# Altium schematic sheet hdmi.SchDoc
size 720 x 297 mm
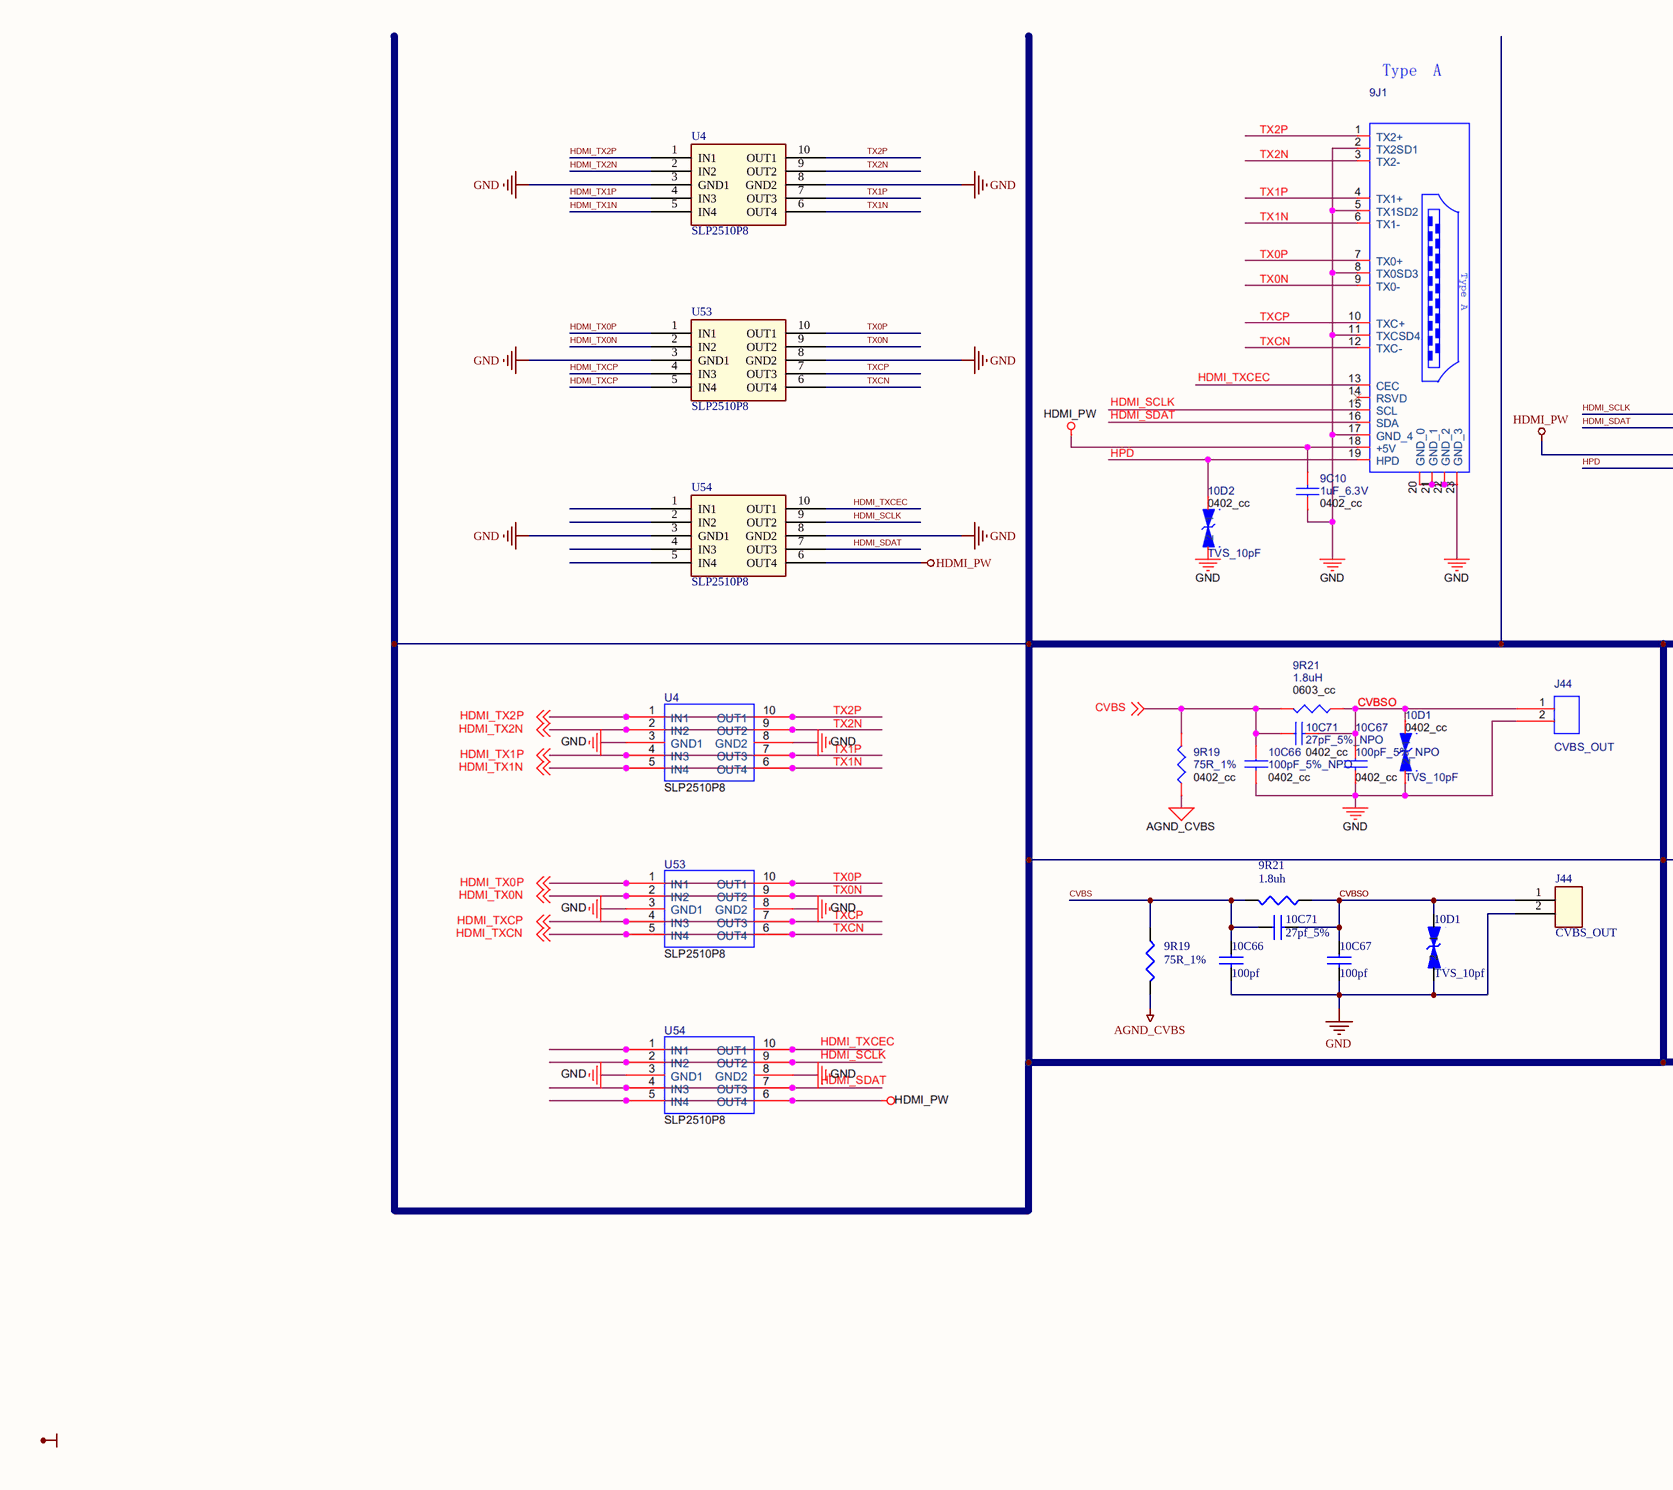
[diagram p0: hdmi.SchDoc, left]
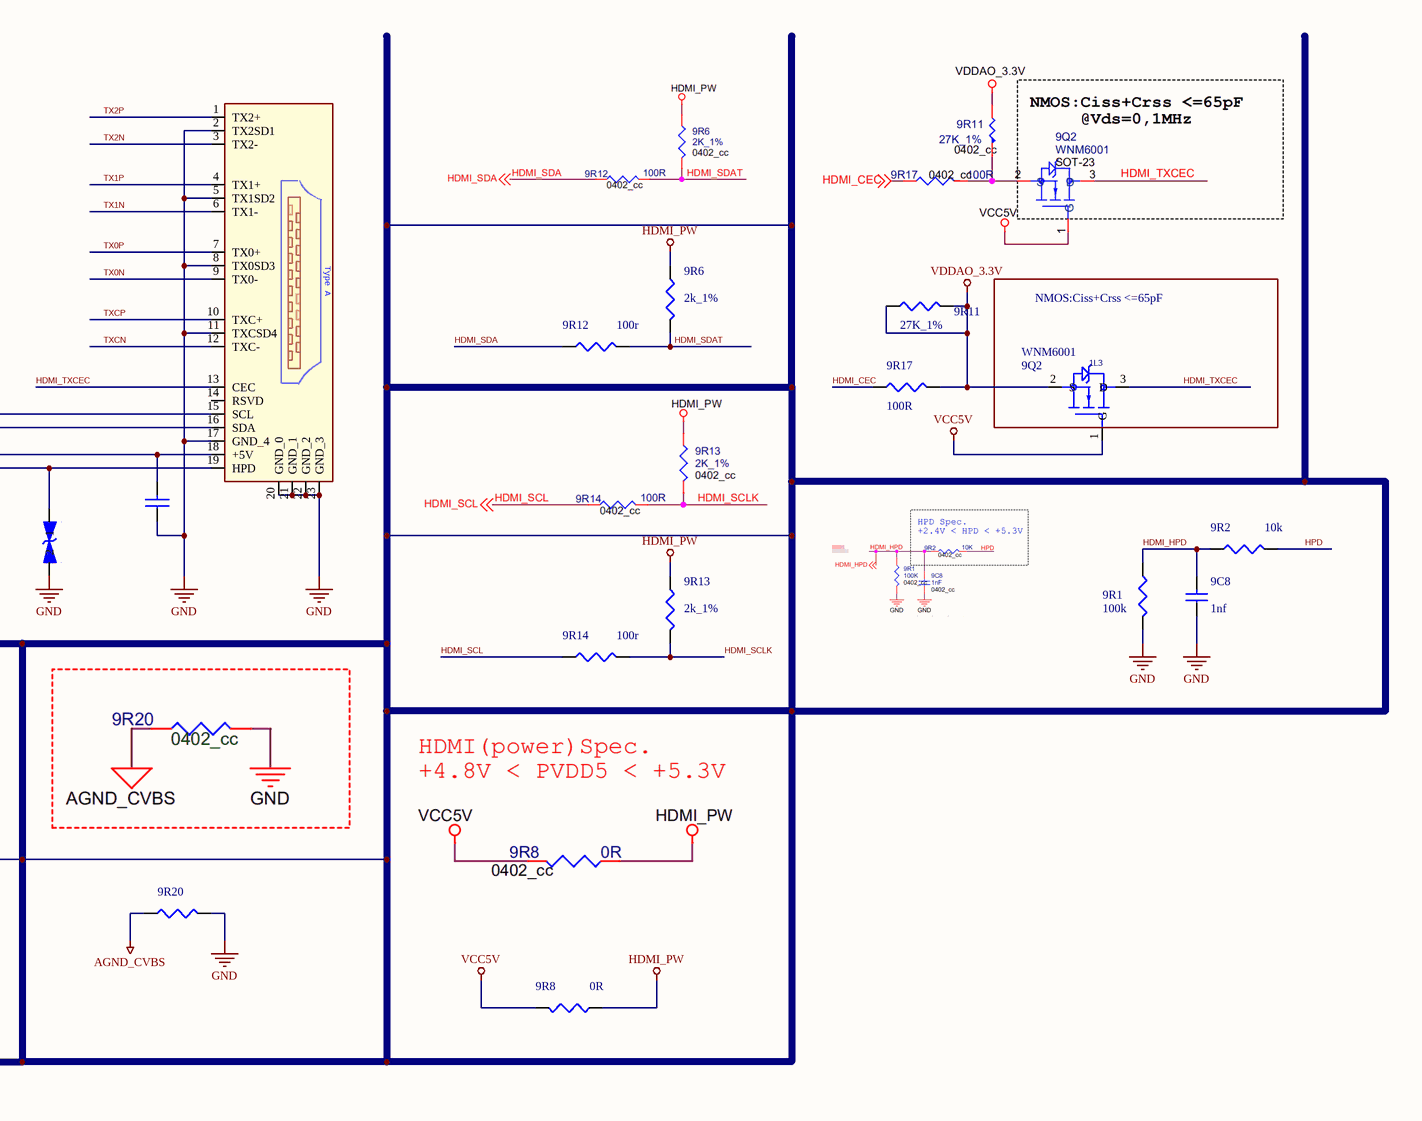
[diagram p1: hdmi.SchDoc, right]

## Parts
9C8  1nf  [0603C]
9C10  (no value)
9J1  (no value)
9Q2  WNM6001  J102: 1L3
9R1  100k
9R2  10k
9R6  2k_1%
9R8  0R
9R11  27K_1%
9R12  100r
9R13  2k_1%
9R14  100r
9R17  100R
9R19  75R_1%
9R20  (no value)
9R21  1.8uh
10C66  100pf
10C67  100pf
10C71  27pf_5%
10D1  TVS_10pf
10D2  (no value)
J44  CVBS_OUT
U4  SLP2510P8
U53  SLP2510P8
U54  SLP2510P8

## Blocks framed on the sheet
NMOS:Ciss+Crss <=65pF: 9Q2

## Nets
AGND_CVBS: 9R19.2 9R20.1
GND: 9C8.1 9C10.1 9J1.2(TX2SD1) 9J1.5(TX1SD2) 9J1.8(TX0SD3) 9J1.11(TXCSD4) 9J1.17(GND_4) 9J1.20(GND_0) 9J1.21(GND_1) 9J1.22(GND_2) 9J1.23(GND_3) 9R1.2 9R20.2 10C66.2 10C67.2 10D1.2 10D2.2 J44.2 U4.3(GND1) U4.8(GND2) U53.3(GND1) U53.8(GND2) U54.3(GND1) U54.8(GND2)
HDMI_PW: 9C10.2 9J1.18(+5V) 9R6.1 9R8.1 9R13.1 U54.6(OUT4)
VCC5V: 9Q2.1(G) 9R8.2
VDDAO_3.3V: 9Q2.2(S) 9R11.1 9R11.2 9R17.1
CVBS: 9R19.1 9R21.2 10C66.1 10C71.1
CVBSO: 9R21.1 10C67.1 10C71.2 10D1.1 J44.1
HDMI_CEC: 9R17.2
HDMI_HPD: 9C8.2 9R1.1 9R2.1
HDMI_SCL: 9R14.1
HDMI_SCLK: 9J1.15(SCL) 9R13.2 9R14.2 U54.9(OUT2)
HDMI_SDA: 9R12.1
HDMI_SDAT: 9J1.16(SDA) 9R6.2 9R12.2 U54.7(OUT3)
HDMI_TX0N: U53.2(IN2)
HDMI_TX0P: U53.1(IN1)
HDMI_TX1N: U4.5(IN4)
HDMI_TX1P: U4.4(IN3)
HDMI_TX2N: U4.2(IN2)
HDMI_TX2P: U4.1(IN1)
HDMI_TXCEC: 9J1.13(CEC) 9Q2.3(D) U54.10(OUT1)
HDMI_TXCP: U53.4(IN3) U53.5(IN4)
HPD: 9J1.19(HPD) 9R2.2 10D2.1
TX0N: 9J1.9(TX0-) U53.9(OUT2)
TX0P: 9J1.7(TX0+) U53.10(OUT1)
TX1N: 9J1.6(TX1-) U4.6(OUT4)
TX1P: 9J1.4(TX1+) U4.7(OUT3)
TX2N: 9J1.3(TX2-) U4.9(OUT2)
TX2P: 9J1.1(TX2+) U4.10(OUT1)
TXCN: 9J1.12(TXC-) U53.6(OUT4)
TXCP: 9J1.10(TXC+) U53.7(OUT3)

Not connected (* = marked no-connect by the designer): 9J1 14(RSVD); U54 1(IN1) 2(IN2) 4(IN3) 5(IN4)

## Notes on the sheet
- (in symbol J-HDMI-TYPE-A-19P_1) Type A

## Library data of the parts
9C8 = capnp
9C10 10C66 10C67 10C71 = CAP NP_6
9J1 = J-HDMI-TYPE-A-19P_1
9Q2 = Mosfetp_4: SOT-23; 1R42: Q1
9R1 9R2 9R6 9R8 9R12-9R14 9R20 = RESISTOR
9R11 9R17 = R
9R19 9R21 = RESISTOR_3
10D1 10D2 = TVS DIODE
J44 = CON2
U4 U53 U54 = rRClamp0524P